# EAGLE schematic ospi_v10 (EAGLE 6.4)
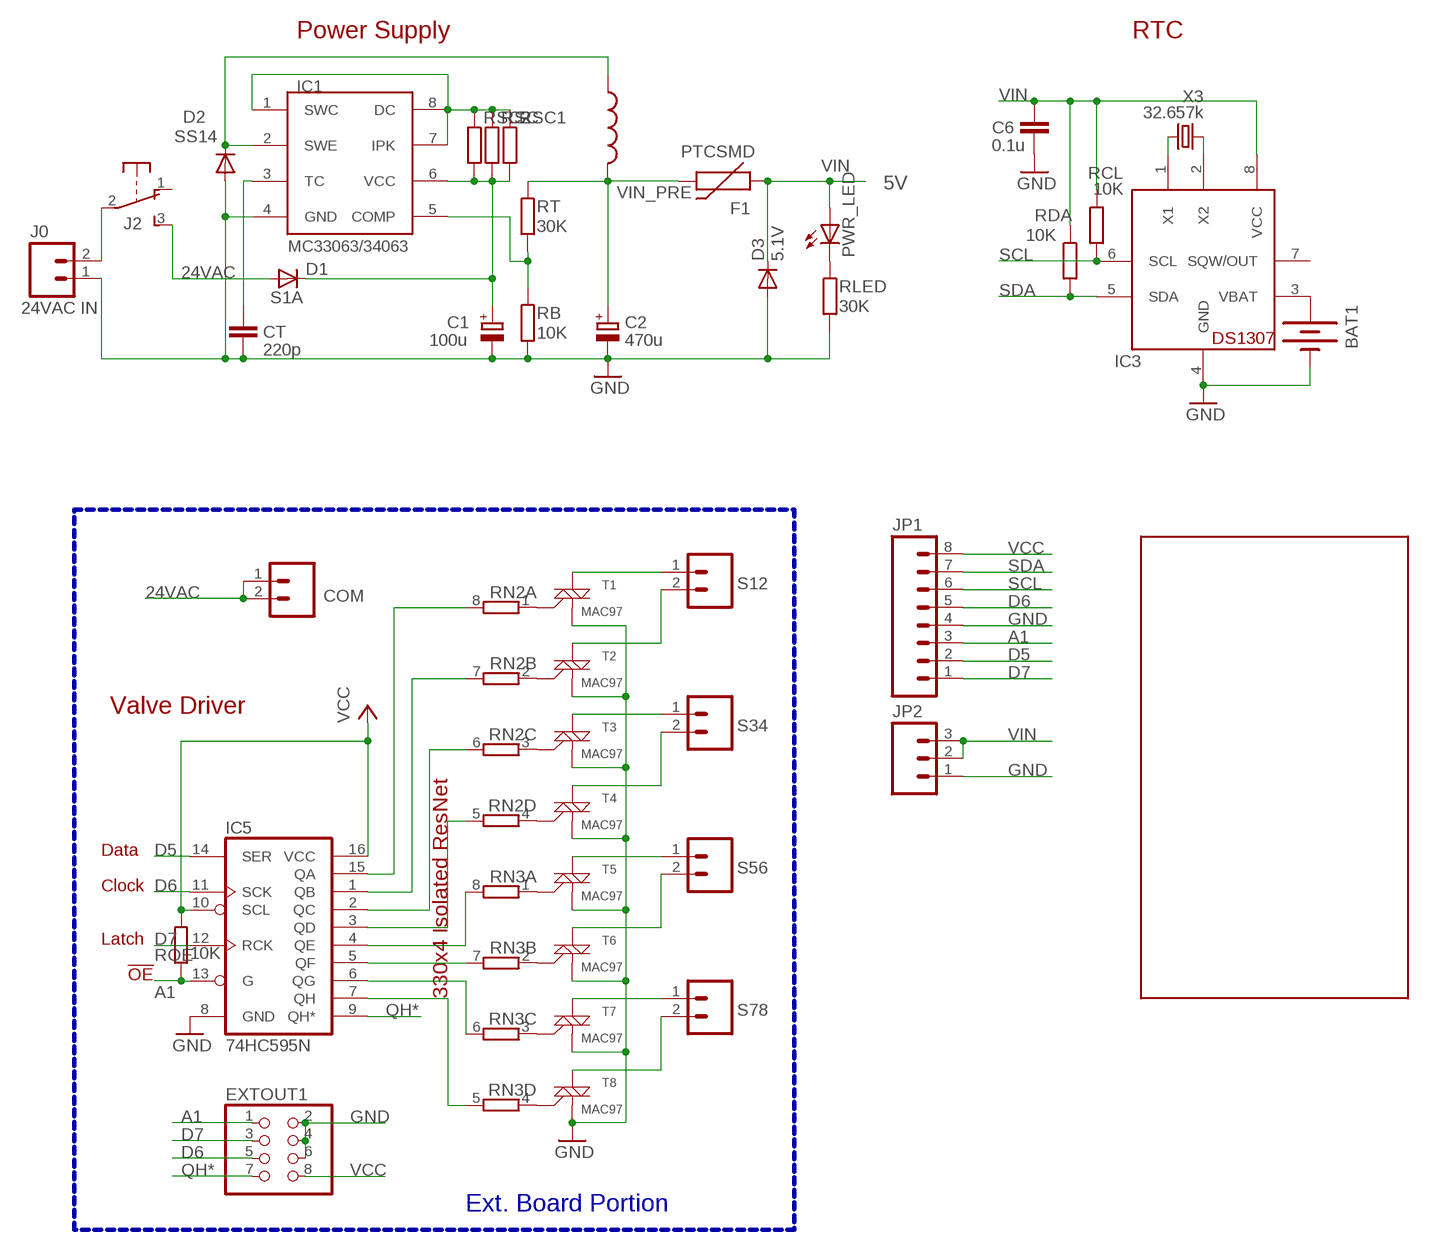
[diagram p0: schematic, sheet 1]

## Parts
BAT1  BATTERYBATTERY_12MM_SMT  [BATTCON_12MM_SMT]
C1  100u  CPOL-EUE3.5-8  [E3,5-8]
C2  470u  CPOL-EUE3.5-8  [E3,5-8]
C6  0.1u  C-EUC0805  [C0805]
COM  M025MM  [SCREWTERMINAL-5MM-2]
CT  220p  C-EUC0805  [C0805]
D1  S1A  DIODE-DO41-7.6  [DO41-7.6]
D2  SS14  DIODE-DO214AC  [DO214AC]
D3  5.1V  DIODE-DO34-7  [DO34-7]
EXTOUT1  PINHD-2X4/90  [2X04/90]
F1  PTCSMD  [PTC-1206]
IC1  MC33063/MC34063D  [SO08]
IC3  DS1307  DS1307SOIC  [SO08]
IC5  74HC595N  74LS595D  [SO16]
J0  24VAC IN  M025MM  [SCREWTERMINAL-5MM-2]
J2  EG1206  [EG1206]
JP1  M08LOCK  [1X08_LOCK]
JP2  M03LOCK  [1X03_LOCK]
L1'  220uH  INDUCTORSRU1038  [SRU1038]
PWR_LED  LEDCHIPLED_0805  [CHIPLED_0805]
RB  10K  R-EU_R0805  [R0805]
RCL  10K  R-EU_R0805  [R0805]
RDA  10K  R-EU_R0805  [R0805]
RLED  30K  R-EU_R0805  [R0805]
RN2  4R-NEXB38V  [EXB38V]
RN3  4R-NEXB38V  [EXB38V]
ROE  10K  R-EU_R0805  [R0805]
RSC  1.0  R-EU_R0805  [R0805]
RSC1  1.0  R-EU_R0805  [R0805]
RSC2  1.0  R-EU_R0805  [R0805]
RT  30K  R-EU_R0805  [R0805]
S12  M025MM  [SCREWTERMINAL-5MM-2]
S34  M025MM  [SCREWTERMINAL-5MM-2]
S56  M025MM  [SCREWTERMINAL-5MM-2]
S78  M025MM  [SCREWTERMINAL-5MM-2]
T1  MAC97  MAC97SOT223  [SOT223]
T2  MAC97  MAC97SOT223  [SOT223]
T3  MAC97  MAC97SOT223  [SOT223]
T4  MAC97  MAC97SOT223  [SOT223]
T5  MAC97  MAC97SOT223  [SOT223]
T6  MAC97  MAC97SOT223  [SOT223]
T7  MAC97  MAC97SOT223  [SOT223]
T8  MAC97  MAC97SOT223  [SOT223]
U$2  OSPI  [OSPI]
X3  32.657k  CRYSTALTC26H  [TC26H]

## Nets
24VAC [power]: COM.1 COM.2 D1.A J2.3(S)
A1: EXTOUT1.1 IC5.13(G) JP1.3 ROE.1
D5: IC5.14(SER) JP1.2
D6: EXTOUT1.5 IC5.11(SCK) JP1.5
D7: EXTOUT1.3 IC5.12(RCK) JP1.1
GND: BAT1.P$1(-) C1.- C2.- C6.2 CT.2 D2.A D3.A EXTOUT1.2 EXTOUT1.4 EXTOUT1.6 IC1.4(GND) IC3.4(GND) IC5.8(GND) J0.1 JP1.4 JP2.1 RB.2 RLED.2 T1.1(M1) T2.1(M1) T3.1(M1) T4.1(M1) T5.1(M1) T6.1(M1) T7.1(M1) T8.1(M1)
N$1: PWR_LED.C RLED.1
N$2 [power]: C1.+ D1.C IC1.6(VCC) RSC1.2 RSC2.2 RSC.2
N$3: RN2.1 T1.3(G)
N$4: IC5.5(QF) RN3.7
N$5: IC5.6(QG) RN3.6
N$6 [power]: J0.2 J2.2(P)
N$7: IC5.7(QH) RN3.5
N$10: IC5.4(QE) RN3.8
N$11: IC5.3(QD) RN2.5
N$12: IC5.2(QC) RN2.6
N$13: IC5.1(QB) RN2.7
N$14: IC5.15(QA) RN2.8
N$15: RN2.2 T2.3(G)
N$16 [power]: S12.1 T1.4(M2)
N$17 [power]: S12.2 T2.4(M2)
N$18 [power]: S34.1 T3.4(M2)
N$19: RN2.3 T3.3(G)
N$20 [power]: S34.2 T4.4(M2)
N$21: RN2.4 T4.3(G)
N$22 [power]: S56.1 T5.4(M2)
N$23 [power]: S56.2 T6.4(M2)
N$24 [power]: S78.1 T7.4(M2)
N$25 [power]: S78.2 T8.4(M2)
N$26: RN3.1 T5.3(G)
N$27: RN3.2 T6.3(G)
N$28: RN3.3 T7.3(G)
N$29: RN3.4 T8.3(G)
N$36: BAT1.P$2(+) IC3.3(VBAT)
N$40 [power]: IC1.1(SWC) IC1.7(IPK) IC1.8(DC) RSC1.1 RSC2.1 RSC.1
N$46 [power]: D2.C IC1.2(SWE) L1'.1
N$47: IC3.1(X1) X3.1
N$49: CT.1 IC1.3(TC)
N$50: IC3.2(X2) X3.2
N$55: IC1.5(COMP) RB.1 RT.2
QH*: EXTOUT1.7 IC5.9(QH*)
SCL: IC3.6(SCL) JP1.6 RCL.2
SDA: IC3.5(SDA) JP1.7 RDA.2
VCC: EXTOUT1.8 IC5.10(SCL) IC5.16(VCC) JP1.8 ROE.2
VIN [power]: C6.1 D3.C F1.1 IC3.8(VCC) JP2.2 JP2.3 PWR_LED.A RCL.1 RDA.1
VIN_PRE [power]: C2.+ F1.2 L1'.2 RT.1
Unconnected: IC3.7(SQW/OUT) J2.1(O)

## Buses
B$1

## Notes on the sheet
- Power Supply | RTC
- 5V
- Valve Driver
- Data
- Clock
- Latch
- !OE
- 330x4 Isolated ResNet
- Ext. Board Portion

## Library data of the parts
BAT1 = SparkFunNew:BATTERY: Battery Holders Various common sizes : AA, AAA, 20mm coin cell and 12mm coin cell.
C1 C2 = resistor:CPOL-EU: POLARIZED CAPACITOR, European symbol
C6 CT = rcl:C-EU: CAPACITOR, European symbol
COM J0 S12 S34 S56 S78 = SparkFun:M02: Header 2 Standard 2-pin 0.1" header. Use with straight break away headers (SKU : PRT-00116), right angle break away headers (PRT-00553), swiss pins (PRT-00743), machine pins (PRT-00117), and female headers (PRT-00115). Molex polarized connector foot print use with SKU : PRT-08233 with associated crimp pins and housings.
D1-D3 = diode:DIODE-: DIODE
EXTOUT1 = pinhead:PINHD-2X4: PIN HEADER
F1 = SparkFun:PTC: Resettable Fuse PTC Resettable Fuse. Spark Fun Electronics SKU : COM-08357
IC1 = adafruit:MC33063/MC34063: MC33063 and MC34063 Basic DC/DC converter with internal power-NPN transistor, 100KHz, 1.5A peak switch current. 3-40 input/output.
IC3 = adafruit:DS1307: DS1307 Real time clock (RTC) with battery backup ability. Talk to it via i2c
IC5 = SparkFun:74*595: 8-bit SHIFT REGISTER, output latch
J2 = adafruit:EG1206
JP1 = SparkFunNew:M08: Header 8 Standard 8-pin 0.1" header. Use with straight break away headers (SKU : PRT-00116), right angle break away headers (PRT-00553), swiss pins (PRT-00743), machine pins (PRT-00117), and female headers (PRT-00115).
JP2 = SparkFun:M03: Header 3 Standard 3-pin 0.1" header. Use with straight break away headers (SKU : PRT-00116), right angle break away headers (PRT-00553), swiss pins (PRT-00743), machine pins (PRT-00117), and female headers (PRT-00115). Molex polarized connector foot print use with SKU : PRT-08232 with associated crimp pins and housings.
L1' = SparkFunNew:INDUCTOR: Inductors Basic Inductor/Choke - 0603 and 1206. Footprints are not proven and vary greatly between part numbers.
PWR_LED = adafruit:LED: LED OSRAM: - CHIPLED LG R971, LG N971, LY N971, LG Q971, LY Q971, LO R971, LY R971 LH N974, LH R974 LS Q976, LO Q976, LY Q976 LO Q996 - Hyper CHIPLED LW Q18S LB Q993, LB Q99A, LB R99A - SideLED LS A670, LO A670, LY A670, LG A670, LP A670 LB A673, LV A673, LT A673, LW A673 LH A674 LY A675 LS A676, LA A676, LO A676, LY A676, LW A676 LS A679, LY A679, LG A679 - Hyper Micro SIDELED® LS Y876, LA Y876, LO Y876, LY Y876 LT Y87S - SmartLED LW L88C, LW L88S LB L89C, LB L89S, LG L890 LS L89K, LO L89K, LY L89K LS L896, LA L896, LO L896, LY L896 - TOPLED LS T670, LO T670, LY T670, LG T670, LP T670 LSG T670, LSP T670, LSY T670, LOP T670, LYG T670 LG T671, LOG T671, LSG T671 LB T673, LV T673, LT T673, LW T673 LH T674 LS T676, LA T676, LO T676, LY T676, LB T676, LH T676, LSB T676, LW T676 LB T67C, LV T67C, LT T67C, LS T67K, LO T67K, LY T67K, LW E67C LS E67B, LA E67B, LO E67B, LY E67B, LB E67C, LV E67C, LT E67C LW T67C LS T679, LY T679, LG T679 LS T770, LO T770, LY T770, LG T770, LP T770 LB T773, LV T773, LT T773, LW T773 LH T774 LS E675, LA E675, LY E675, LS T675 LS T776, LA T776, LO T776, LY T776, LB T776 LHGB T686 LT T68C, LB T68C - Hyper Mini TOPLED® LB M676 - Mini TOPLED Santana® LG M470 LS M47K, LO M47K, LY M47K Source: http://www.osram.convergy.de/
RB RCL RDA RLED ROE RSC RSC1 RSC2 RT = rcl:R-EU_: RESISTOR, European symbol
RN2 RN3 = resistor-dil:4R-N: Array Chip Resistor Source: RS Component / Phycomp; OC_FARNELL: unknown; OC_NEWARK: unknown
T1-T8 = SparkFun:MAC97: MAC97 Triac http://www.onsemi.com/pub_link/Collateral/MAC97-D.PDF
U$2 = RaspberryPi:OSPI
X3 = crystal:CRYSTAL: CRYSTAL; OC_FARNELL: unknown; OC_NEWARK: unknown

## Net classes
0 default: width 0.254 mm, clearance 0.203 mm
1 power: width 0.762 mm, clearance 0.203 mm